# EasyEDA Pro project TTL to RS485 Converter V1.1.eprj

# Schematic TTL to RS485 Converter
Board Name: TTL to RS485 Converter; Create Date: 2026-04-04; Page Name: Sheet_1; Project Name: TTL to RS485 Converter V1.1; Schematic Name: TTL to RS485 Converter; Update Date: 2026-04-04; Add into BOM: yes; Company: Vision World Tech Pvt Ltd; Convert to PCB: yes; Date: 2025-11-25; REV: 1.0; Sheet: 1/1; spicePre: .
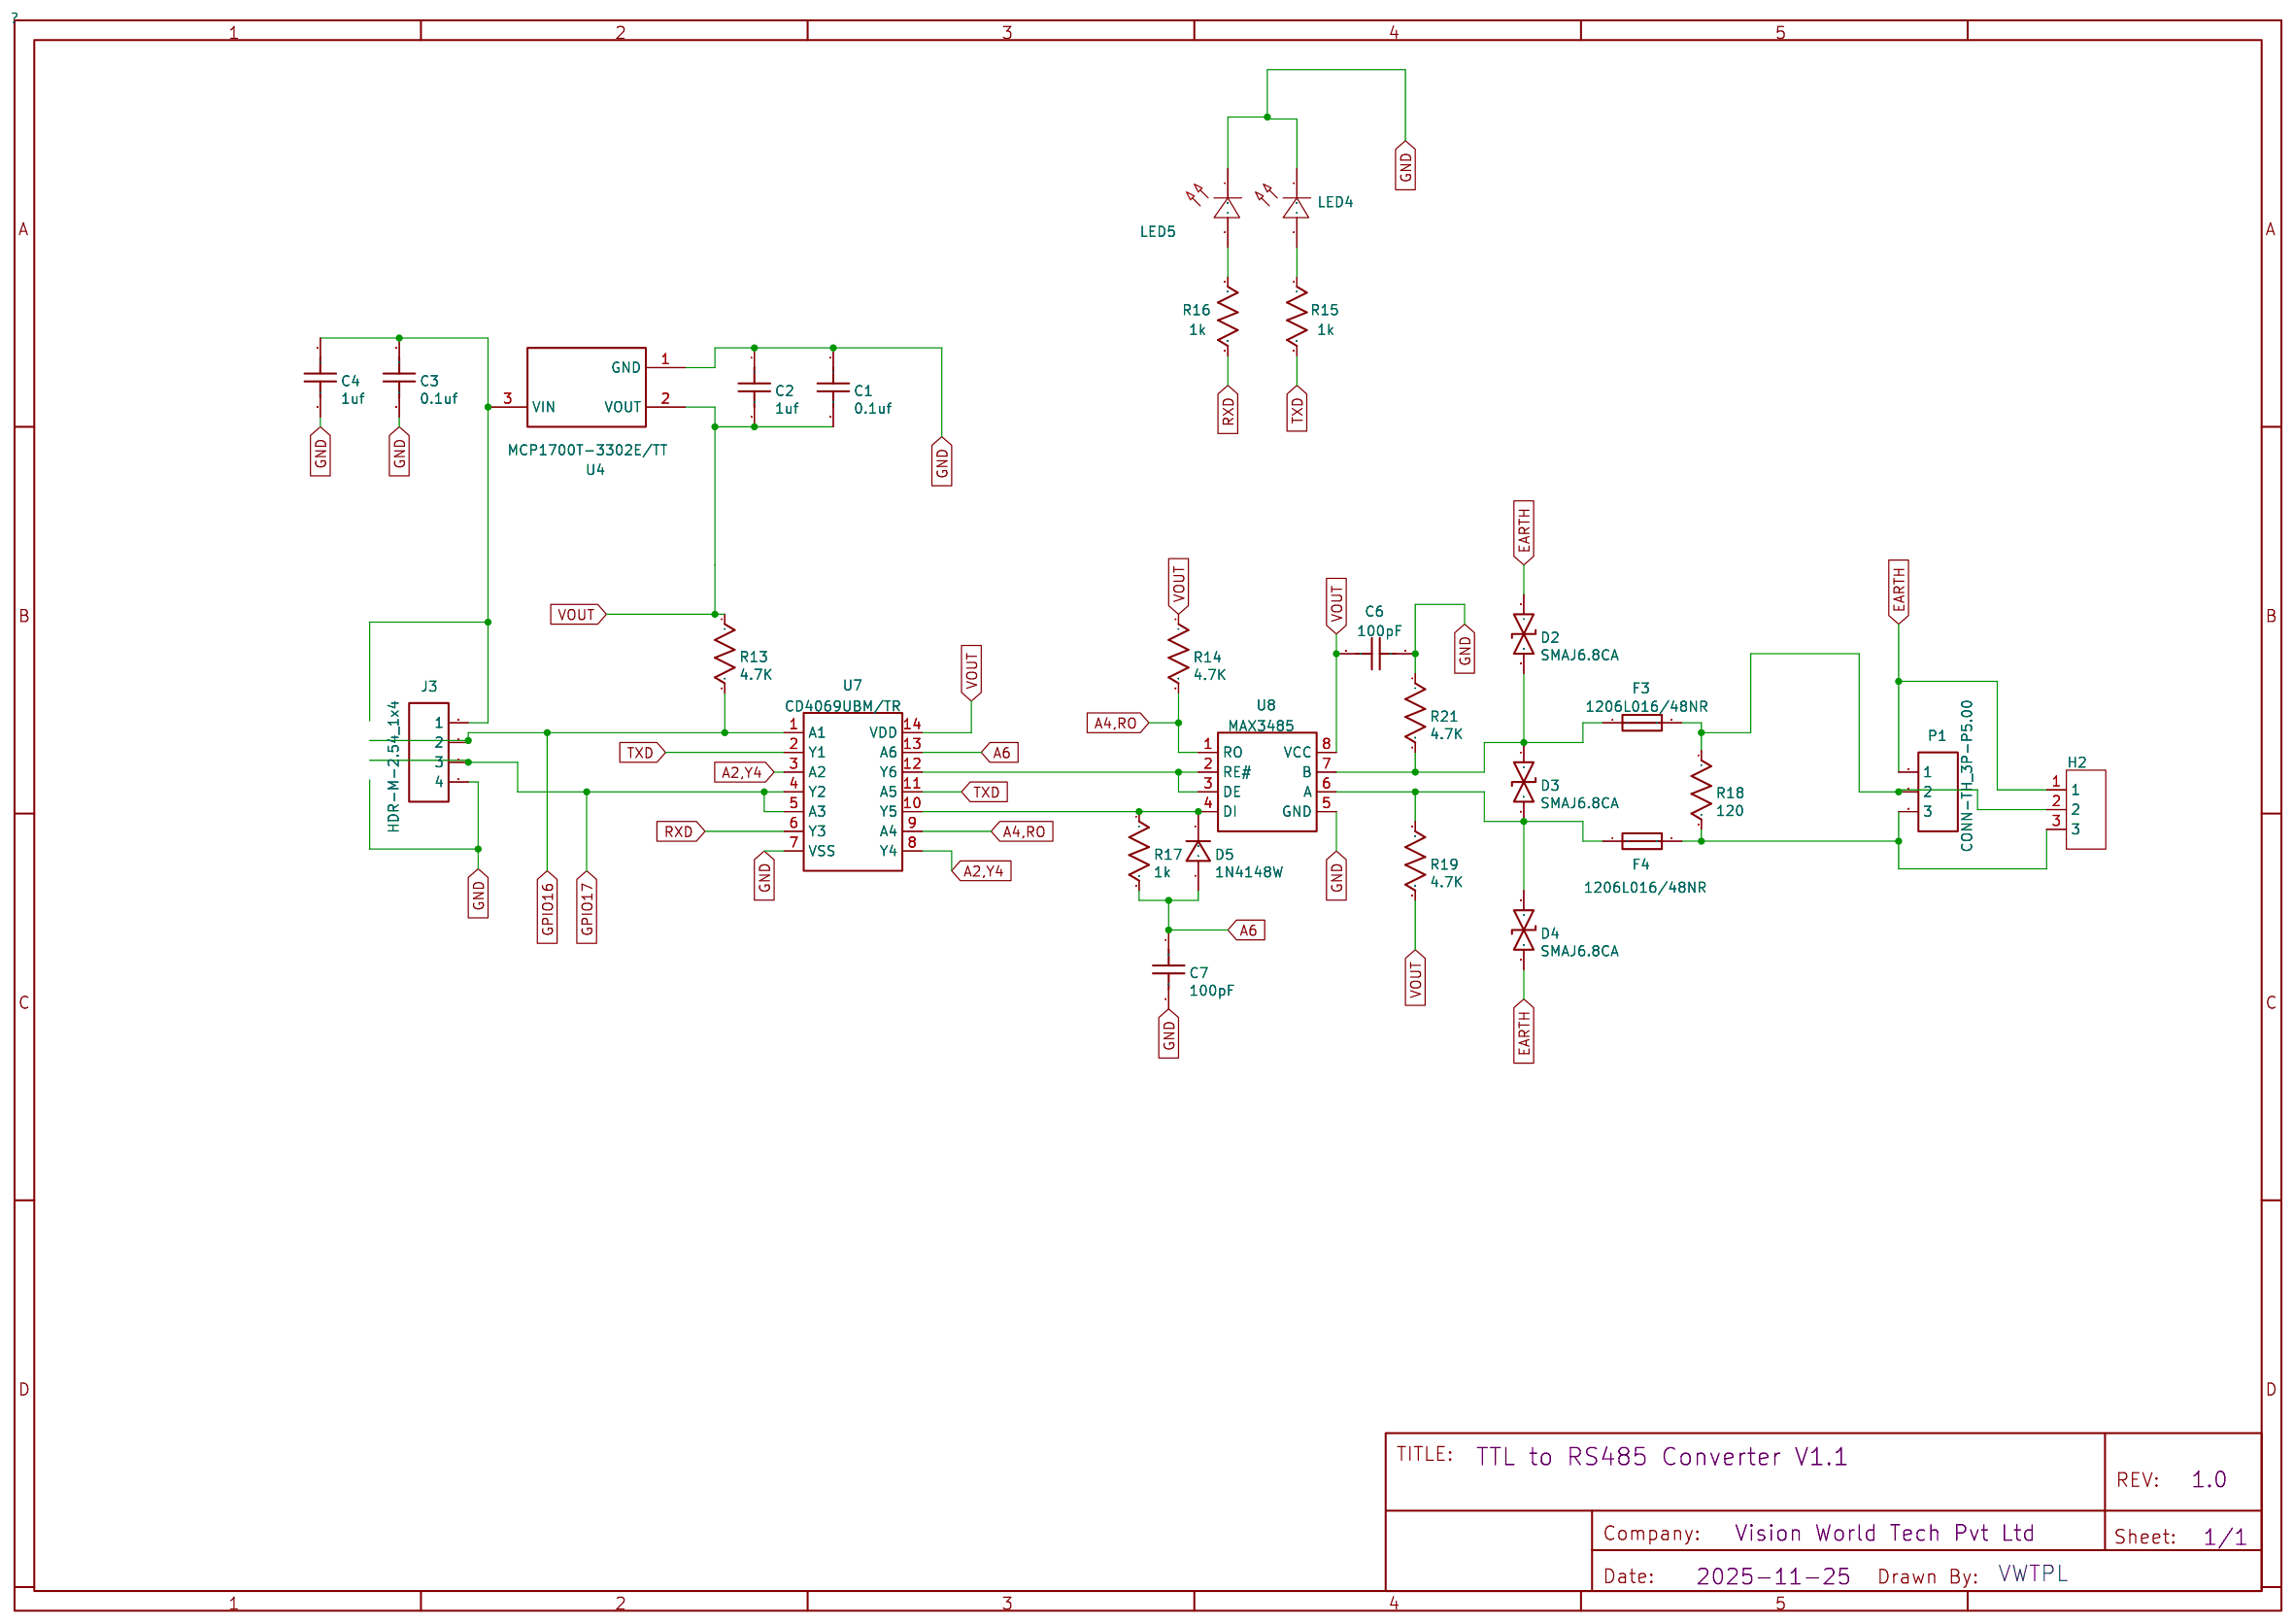
[diagram p0: schematic sheet]

## Parts
C1  0.1uf  [C1206]
C2  1uf  [C1206]
C3  0.1uf  [C1206]
C4  1uf  [C1206]
C6  100pF  [C1206]
C7  100pF  [C1206]
D2  SMAJ6.8CA  [SMA_L4.4-W2.6-LS5.0-BI]
D3  SMAJ6.8CA  [SMA_L4.4-W2.6-LS5.0-BI]
D4  SMAJ6.8CA  [SMA_L4.4-W2.6-LS5.0-BI]
D5  1N4148W  [SOD-123FL_L2.6-W1.6-LS3.4-RD]
F3  1206L016/48NR  [FUSE-SMD_1206L016-48NR]
F4  1206L016/48NR  [FUSE-SMD_1206L016-48NR]
H2  -  [HDR-TH_3P-P2.54-V-M]
J3  HDR-M-2.54_1x4  [HDR-M-2.54_1X4]
LED4  -  [LED0805-RD_GREEN]
LED5  -  [LED0805-RD_GREEN]
P1  CONN-TH_3P-P5.00  [CONN-TH_3P-P5.00]
R13  4.7K  [R1206]
R14  4.7K  [R1206]
R15  1k  [R1206]
R16  1k  [R1206]
R17  1k  [R1206]
R18  120  [R1206]
R19  4.7K  [R1206]
R21  4.7K  [R1206]
U4  MCP1700T-3302E/TT  [MCP1700-SOT-23-3_L2.9-W1.6-P1.90-LS2.8-BR]
U7  CD4069UBM/TR  [SOIC-14_L8.7-W3.9-P1.27-LS6.0-BL]
U8  MAX3485  [SOP-8_L4.9-W3.9-P1.27-LS6.0-BL]

## Library data of the parts
C1 C3 = 0.1uf: nameAlias: Value(F); Contributor: LCEDA_Lib; spicePre: C; spiceSymbolName: C_1206_US
C2 C4 = 1uf: nameAlias: Value(F); Contributor: LCEDA_Lib; spicePre: C; spiceSymbolName: C_1206_US
C6 C7 = 100pF: nameAlias: Value(F); Contributor: LCEDA_Lib; spicePre: C; spiceSymbolName: C_1206_US
D2-D4 = SMAJ6.8CA: Supplier: LCSC; Supplier Part: C406209; Manufacturer: BORN(伯恩半导体); JLCPCB Part Class: Extended Part; Contributor: LCSC; spicePre: D
D5 = 1N4148W: Supplier: LCSC; Manufacturer: Tak Cheong; Supplier Part: C129216; Contributor: LCEDA_Lib; spicePre: D
F3 F4 = 1206L016/48NR: Supplier: LCSC; Supplier Part: C7542930; Manufacturer: LUTE(陆特); JLCPCB Part Class: Extended Part; Contributor: lcsc; spicePre: F
H2 = HDR-M_2.54_1x3P: Supplier Footprint: Through
J3 = HDR-M-2.54_1x4: Supplier Part: C124378; Supplier: LCSC; Contributor: LCEDA_Lib; spicePre: J
LED4 = LED_0805-B: Supplier Footprint: 0805
LED5 = LED_0805-G: Supplier Footprint: 0805
P1 = CONN-TH_3P-P5.00: Supplier: LCSC; Contributor: LCEDA_Lib; spicePre: P
R13 R14 R19 R21 = 4.7K: nameAlias: Value(Ω); Contributor: LCEDA_Lib; spicePre: R; spiceSymbolName: R_1206_US
R15-R17 = 1k: nameAlias: Value(Ω); Contributor: LCEDA_Lib; spicePre: R; spiceSymbolName: R_1206_US
R18 = 120: nameAlias: Value(Ω); Contributor: LCEDA_Lib; spicePre: R; spiceSymbolName: R_1206_US
U4 = MCP1700T-3302E/TT: Supplier: LCSC; Manufacturer: MICROCHIP; image: //image.lceda.cn/szlcsc/C39051.jpg; Supplier Part: C39051; JLCPCB Part Class: Extend; LCSC Assembly: Yes; Contributor: Lavar Technologies; spicePre: U
U7 = CD4069UBM/TR: Supplier: LCSC; Supplier Part: C194330; Manufacturer: HGSEMI(华冠); JLCPCB Part Class: Extended Part; Contributor: LCSC; spicePre: U
U8 = MAX3485: Supplier: LCSC; Supplier Part: C41438299; Manufacturer: ElecSuper(静芯微); Manufacturer Part: MAX3485EIM/TR(ES); Contributor: lcsc; spicePre: U; spiceSymbolName: MAX3485EIM/TR(ES)

## Nets
GND: C1.1 C2.1 C3.2 C4.2 C6.1 C7.2 J3.4 LED4.1(C) LED5.1(C) R21.1 U4.1(GND) U7.7(VSS) U8.5(GND)
A2,Y4: U7.3(A2) U7.8(Y4)
A4,RO: R14.2 U7.9(A4) U8.1(RO)
A6: C7.1 D5.2 R17.2 U7.13(A6)
EARTH: D2.1 D4.2 H2.1 P1.1
GPIO16: J3.2 R13.2 U7.1(A1)
GPIO17: J3.3 U7.4(Y2) U7.5(A3)
RXD: R16.2 U7.6(Y3)
TXD: R15.2 U7.2(Y1) U7.11(A5)
VOUT: C1.2 C2.2 C6.2 R13.1 R14.1 R19.2 U4.2(VOUT) U7.14(VDD) U8.8(VCC)
$1N7: D5.1 R17.1 U7.10(Y5) U8.4(DI)
$1N9: U7.12(Y6) U8.2(RE#) U8.3(DE)
$1N18: D2.2 D3.1 F3.1 R21.2 U8.7(B)
$1N21: D3.2 D4.1 F4.1 R19.1 U8.6(A)
$1N22: F3.2 H2.2 P1.2 R18.1
$1N26: F4.2 H2.3 P1.3 R18.2
$1N31: LED5.2(A) R16.1
$1N32: LED4.2(A) R15.1
Net-(C3-1): C3.1 C4.1 J3.1 U4.3(VIN)

## Notes on the sheet
- VWTPL

# Board PCB_TTL to RS485 Converter
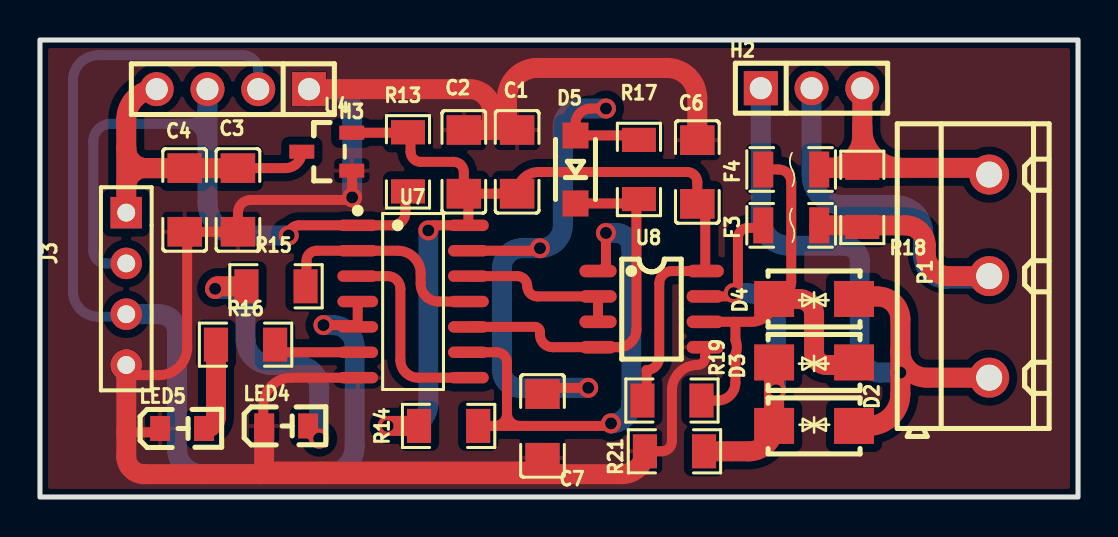
[diagram p1: board, top side]
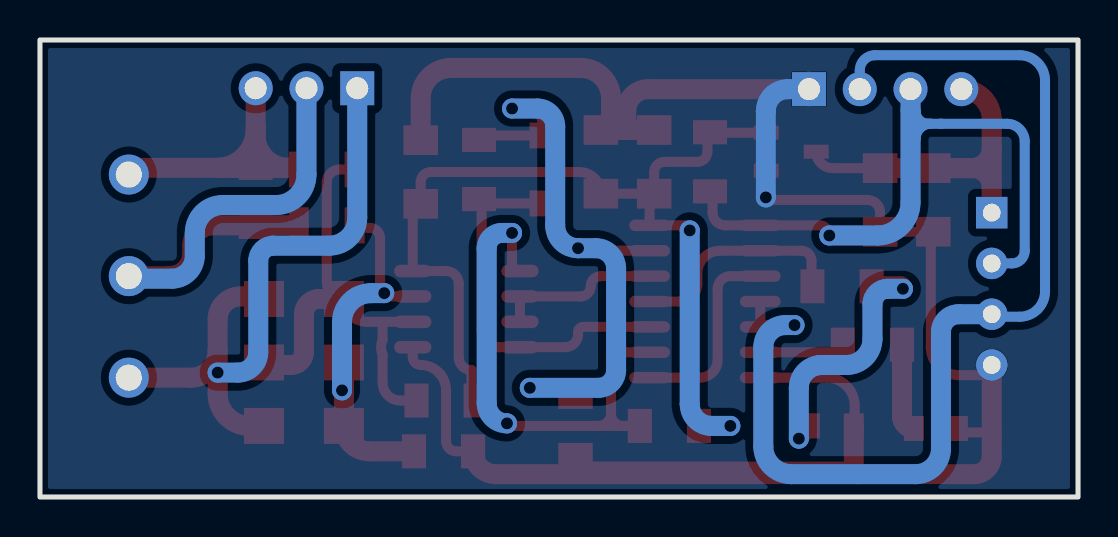
[diagram p2: board, bottom side, seen from below]

Outline 51.94 x 22.86 mm; copper layers: Top Layer, Bottom Layer. Coordinates in mm from the lower left corner of the outline.
Outline path: rectangle 0,22.86 51.94,0
Stack: Top Layer 0.035mm / Dielectric1 1.51mm FR4 er 4.5 / Bottom Layer 0.035mm

## Design rules (mm)
spacing Default (default): track to track 0.4, other pairs 0 to 0.4
track width Default (default): min 0.5, default 0.5, max 25.4
differential pair differentialPair (default): width min 0.127, default 0.254, max 2.54; gap min 0.152, default 0.152
via Default (default): diameter min 1, default 1, max 100.025; hole min 0.6, default 0.6, max 59.995

## Placement (name value [footprint] x y rotation side)
C1  0.1uf  [C1206]  23.88 16.76 270 top
C2  1uf  [C1206]  21.21 16.76 270 top
C3  0.1uf  [C1206]  9.91 14.86 270 top
C4  1uf  [C1206]  7.24 14.86 270 top
C6  100pF  [C1206]  32.89 16.26 270 top
C7  100pF  [C1206]  25.15 3.56 270 top
D2  SMAJ6.8CA  [SMA_L4.4-W2.6-LS5.0-BI]  38.74 3.56 180 top
D3  SMAJ6.8CA  [SMA_L4.4-W2.6-LS5.0-BI]  38.74 6.73 0 top
D4  SMAJ6.8CA  [SMA_L4.4-W2.6-LS5.0-BI]  38.74 9.91 0 top
D5  1N4148W  [SOD-123FL_L2.6-W1.6-LS3.4-RD]  26.8 16.38 270 top
F3  1206L016/48NR  [FUSE-SMD_1206L016-48NR]  37.59 13.59 0 top
F4  1206L016/48NR  [FUSE-SMD_1206L016-48NR]  37.59 16.38 0 top
H2  -  [HDR-TH_3P-P2.54-V-M]  38.61 20.45 0 top
H3  -  [HDR-TH_4P-P2.54-V-M]  9.65 20.4 180 top
J3  HDR-M-2.54_1x4  [HDR-M-2.54_1X4]  4.32 10.41 270 top
LED4  -  [LED0805-RD_GREEN]  12.32 3.56 0 top
LED5  -  [LED0805-RD_GREEN]  7.11 3.43 0 top
P1  -  [CONN-TH_3P-P5.00]  47.5 11.05 90 top
R13  4.7K  [R1206]  18.41 16.76 270 top
R14  4.7K  [R1206]  20.45 3.56 0 top
R15  1k  [R1206]  11.81 10.54 0 top
R16  1k  [R1206]  10.29 7.62 0 top
R17  1k  [R1206]  29.97 16.38 90 top
R18  120  [R1206]  41.15 14.99 90 top
R19  4.7K  [R1206]  31.62 4.83 180 top
R21  4.7K  [R1206]  31.75 2.29 0 top
U4  MCP1700T-3302E/TT  [MCP1700-SOT-23-3_L2.9-W1.6-P1.90-LS2.8-BR]  14.35 17.27 0 top
U7  CD4069UBM/TR  [SOIC-14_L8.7-W3.9-P1.27-LS6.0-BL]  18.67 9.78 270 top
U8  MAX3485  [SOP-8_L4.9-W3.9-P1.27-LS6.0-BL]  30.61 9.4 270 top

## Footprints (pads in the part's own frame, mm; a bottom-side part is the same pattern mirrored in y, then rotated)
C1206
  rect 1.485x1.728 smd: 1(-1.593,0) 2(1.593,0)
CONN-TH_3P-P5.00
  round 2 hole 1.3: 1(-5.08,0) 2(0,0) 3(5.08,0)
FUSE-SMD_1206L016-48NR
  rect 1x1.8 smd: 1(-1.4,0) 2(1.4,0)
HDR-M-2.54_1X4
  rect 1.575x1.575 hole 0.889: 1(-3.81,0)
  round 1.575 hole 0.889: 2(-1.27,0) 3(1.27,0) 4(3.81,0)
HDR-TH_3P-P2.54-V-M
  rect 1.7x1.7 hole 1.1: 1(-2.54,0)
  round 1.7 hole 1.1: 2(0,0) 3(2.54,0)
HDR-TH_4P-P2.54-V-M
  rect 1.7x1.7 hole 1.1: 1(-3.81,0)
  round 1.7 hole 1.1: 2(-1.27,0) 3(1.27,0) 4(3.81,0)
LED0805-RD_GREEN
  rect 1x1.25 smd: 1(-1.1,0) 2(1.1,0)
MCP1700-SOT-23-3_L2.9-W1.6-P1.90-LS2.8-BR
  rect 1.25x0.7 smd: 1(1.25,-0.95) 2(1.25,0.95) 3(-1.25,0)
R1206
  rect 1.208x1.701 smd: 1(-1.479,0) 2(1.479,0)
SMA_L4.4-W2.6-LS5.0-BI
  rect 2x1.8 smd: 1(-2,0) 2(2,0)
SOD-123FL_L2.6-W1.6-LS3.4-RD
  rect 1.3x1.3 smd: 1(1.7,0) 2(-1.7,0)
SOIC-14_L8.7-W3.9-P1.27-LS6.0-BL
  oval 0.574x2.038 smd: 1(-3.81,-2.769) 2(-2.54,-2.769) 3(-1.27,-2.769) 4(0,-2.769) 5(1.27,-2.769) 6(2.54,-2.769) 7(3.81,-2.769) 8(3.81,2.769) 9(2.54,2.769) 10(1.27,2.769) 11(0,2.769) 12(-1.27,2.769) 13(-2.54,2.769) 14(-3.81,2.769)
SOP-8_L4.9-W3.9-P1.27-LS6.0-BL
  oval 0.63x1.865 smd: 1(-1.905,-2.683) 2(-0.635,-2.683) 3(0.635,-2.683) 4(1.905,-2.683) 5(1.905,2.683) 6(0.635,2.683) 7(-0.635,2.683) 8(-1.905,2.683)

## Nets
GND: C1.1 C2.1 C3.2 C4.2 C6.1 C7.2 H3.1 J3.4 LED4.1 LED5.1 R21.1 U4.1 U7.7 U8.5
A2,Y4: U7.3 U7.8
A4,RO: R14.2 U7.9 U8.1
A6: C7.1 D5.2 R17.2 U7.13
EARTH: D2.1 D4.2 H2.1 P1.1
GPIO16: H3.3 J3.2 R13.2 U7.1
GPIO17: H3.2 J3.3 U7.4 U7.5
RXD: R16.2 U7.6
TXD: R15.2 U7.2 U7.11
VOUT: C1.2 C2.2 C6.2 R13.1 R14.1 R19.2 U4.2 U7.14 U8.8
$1N7: D5.1 R17.1 U7.10 U8.4
$1N9: U7.12 U8.2 U8.3
$1N18: D2.2 D3.1 F3.1 R21.2 U8.7
$1N21: D3.2 D4.1 F4.1 R19.1 U8.6
$1N22: F3.2 H2.2 P1.2 R18.1
$1N26: F4.2 H2.3 P1.3 R18.2
$1N31: LED5.2 R16.1
$1N32: LED4.2 R15.1
$1N35: C3.1 C4.1 H3.4 J3.1 U4.3

## Via types
v1: diameter 1, hole 0.6, Top Layer to Bottom Layer, 15 vias

## Routing (per net, layer and track width the routed paths; a pad name or vN(x,y) marks a point on that pad's centre or on a via; arc(x,y) is an arc through that point)
GND: length 120.3
  Top Layer w0.5: 4.32,6.1 5.97,6.1 arc(6.96,6.51) 7.37,7.49 7.37,13.27 ; 7.37,13.27 C3.2 9.91,14.22 arc(10.09,14.67) 10.54,14.86 15.49,14.86 arc(15.58,14.9) v1(15.62,14.99) 15.62,16.3 arc(15.61,16.32) U4.1 ; 7.37,13.27 C4.2 ; R21.1 31.12,2.29 arc(31.47,2.43) 31.62,2.79 31.62,5.33 arc(31.7,5.77) 31.92,6.15 arc(32.36,6.49) 32.89,6.6 arc(33.17,6.72) 33.29,7 U8.5 ; 11.18,3.56 11.18,4.57 arc(11.59,5.56) 12.57,5.97 U7.7 ; 4.32,3.23 5.81,3.23 arc(5.95,3.29) LED5.1 ; 11.22,1.52 25.15,1.52 ; 22.61,18.38 arc(22.6,18.36) 22.58,18.36
  Top Layer w1: 22.61,18.38 22.61,19.3 arc(22.28,20.08) 21.51,20.4 H3.1 ; 11.04,1.14 5.21,1.14 arc(4.58,1.4) 4.32,2.03 J3.4 ; 11.04,1.14 29.13,1.14 arc(29.94,1.48) R21.1 ; 11.04,1.14 arc(11.17,1.19) 11.22,1.32 LED4.1 ; C6.1 32.89,19.94 arc(32.45,21.02) 31.37,21.46 24.89,21.46 arc(23.81,21.02) 23.37,19.94 23.37,18.86 arc(23.52,18.51) C1.1 C2.1
  Bottom Layer w0.5: 13.46,20.3 13.46,20.27
  Bottom Layer w1: v1(15.62,14.99) 15.62,19.3 arc(15.3,20.08) 14.53,20.4 H3.1
A2,Y4: length 10
  Top Layer w0.5: U7.3 17.4,11.05 arc(17.85,10.86) 18.03,10.41 18.03,6.86 arc(18.29,6.23) 18.92,5.97 U7.8
A4,RO: length 28
  Top Layer w0.5: 22.18,3.56 22.77,3.56 arc(23.19,3.73) 23.37,4.15 23.37,4.96 ; v1(28.32,13.21) 28.32,11.7 arc(28.2,11.42) U8.1 ; U7.9 22.86,7.24 arc(23.22,7.09) 23.37,6.73 23.37,4.19 arc(23.55,3.74) 24,3.56 ; R14.2 24,3.56 ; 24,3.56 28.45,3.56 arc(28.54,3.59) v1(28.58,3.68)
  Bottom Layer w1: v1(28.32,13.21) 28.83,13.21 arc(29.37,12.98) 29.59,12.45 29.59,4.7 arc(29.29,3.98) v1(28.58,3.68)
A6: length 33.8
  Top Layer w0.5: U7.13 24.89,12.32 arc(24.98,12.36) v1(25.02,12.45) ; v1(28.32,19.43) 27.56,19.43 arc(27.02,19.21) 26.8,18.67 D5.2 29.75,18.08 arc(29.91,18.02) R17.2 ; v1(27.43,5.46) 25.46,5.46 arc(25.24,5.37) C7.1
  Bottom Layer w1: v1(27.43,5.46) 24,5.46 arc(23.37,5.72) 23.11,6.35 23.11,11.43 arc(23.41,12.15) 24.13,12.45 v1(25.02,12.45) arc(25.83,12.78) 26.16,13.59 26.16,18.54 arc(26.42,19.17) 27.05,19.43 v1(28.32,19.43)
EARTH: length 35.3
  Top Layer w1: 43.05,7.3 v1(43.05,6.22) 43.05,5.16 arc(42.58,4.02) 41.45,3.56 D2.1 ; 43.05,7.3 43.05,8.89 arc(42.72,9.7) 41.91,10.03 40.86,10.03 arc(40.77,10) D4.2 ; 43.05,7.3 arc(43.13,6.86) 43.35,6.46 arc(43.81,6.1) 44.38,5.97 P1.1
  Bottom Layer w0.5: 36.06,20.04 36.06,20.28
  Bottom Layer w1: v1(43.05,6.22) 42.04,6.22 arc(41.32,6.52) 41.02,7.24 41.02,11.81 arc(40.8,12.35) 40.26,12.57 37.47,12.57 arc(36.48,12.98) 36.07,13.97 H2.1
GPIO16: length 36.2
  Top Layer w0.5: R13.2 arc(18.33,15.25) 18.29,15.16 18.29,14.22 arc(18.1,13.77) 17.65,13.59 U7.1 12.95,13.59 arc(12.59,13.44) v1(12.45,13.08)
  Bottom Layer w0.5: J3.2 3.3,11.68 arc(2.85,11.87) 2.67,12.32 2.67,17.78 arc(2.93,18.41) 3.56,18.67 7.71,18.67 arc(8.19,18.86) 8.38,19.34 ; 6.84,18.67 6.89,18.67 6.84,18.67 ; 7.37,18.67 arc(7.9,18.45) 8.13,17.91 8.13,19.3 arc(7.94,18.85) 7.49,18.67 7.37,18.67
  Bottom Layer w1: v1(12.45,13.08) 10.03,13.08 arc(8.87,13.56) 8.38,14.73 H3.3
GPIO17: length 54.9
  Top Layer w0.5: v1(14.19,8.6) 15.81,8.6 arc(15.87,8.57) U7.5 U7.4
  Bottom Layer w0.5: H3.2 10.92,21.34 arc(10.7,21.87) 10.16,22.1 2.92,22.1 arc(2.02,21.73) 1.65,20.83 1.65,10.29 arc(2.02,9.39) 2.92,9.02 4.19,9.02 arc(4.28,9.05) J3.3
  Bottom Layer w1: v1(14.19,8.6) 14.64,8.6 arc(15.42,8.28) 15.75,7.5 15.75,2.54 arc(15.34,1.55) 14.35,1.14 8.13,1.14 arc(7.23,1.51) 6.86,2.41 6.86,8.26 arc(6.6,8.88) 5.97,9.14 J3.3
RXD: length 4.1
  Top Layer w0.5: U7.6 11.77,7.24
TXD: length 11.4
  Top Layer w0.5: U7.11 19.94,9.78 arc(19.31,10.04) 19.05,10.67 19.05,11.18 arc(18.72,11.98) 17.91,12.32 U7.2 13.84,12.32 arc(13.48,12.17) 13.34,11.81 13.34,10.59 arc(13.32,10.55) 13.29,10.54
VOUT: length 51.2
  Top Layer w0.5: C2.2 21.21,16.26 arc(21.06,16.62) 20.7,16.76 19.05,16.76 arc(18.69,16.91) 18.54,17.27 18.54,18.12 arc(18.5,18.21) R13.1 arc(18.41,18.23) 18.39,18.22 U4.2 ; C2.2 C1.2 arc(24.19,15.94) 24.96,16.26 32.38,16.26 arc(32.74,16.11) 32.89,15.75 C6.2 arc(33.17,14.55) 33.29,14.27 U8.8 31.62,11.3 arc(31.17,11.12) 30.99,10.67 30.99,6.98 arc(30.8,6.54) 30.35,6.35 30.35,5.04 arc(30.29,4.89) 30.14,4.83 ; C2.2 arc(21.37,15.1) 21.44,14.94 U7.14 19.69,13.59 arc(19.51,13.51) v1(19.43,13.34)
  Top Layer w1: v1(17.4,3.56) 18.97,3.56
  Bottom Layer w1: v1(17.4,3.56) 18.34,3.56 arc(19.11,3.88) 19.43,4.65 v1(19.43,13.34)
$1N7: length 19.2
  Top Layer w0.5: D5.1 29.75,14.68 ; 29.75,14.68 arc(29.91,14.75) R17.1 ; 29.75,14.68 arc(29.82,14.65) 29.84,14.59 29.84,8.38 arc(29.58,7.75) 28.96,7.49 U8.4 25.65,7.49 arc(25.2,7.68) 25.02,8.13 25.02,8.26 arc(24.94,8.43) 24.77,8.51 U7.10
$1N9: length 8.3
  Top Layer w0.5: U8.3 U8.2 24.89,10.03 arc(24.53,10.18) 24.38,10.54 arc(24.24,10.9) 23.88,11.05 U7.12
$1N18: length 19.7
  Top Layer w0.5: U8.7 34.55,10.03 arc(34.67,10.08) v1(34.72,10.2) arc(34.87,10.41) 34.93,10.67 34.93,12.95 arc(35.07,13.31) 35.43,13.46 36.06,13.46 arc(36.15,13.5) F3.1
  Top Layer w1: D3.1 D2.2 arc(36.36,2.66) 35.47,2.29 R21.2
  Bottom Layer w1: v1(36.83,5.33) 36.83,8.74 arc(36.4,9.77) 35.38,10.2 v1(34.72,10.2)
$1N21: length 24.3
  Top Layer w0.5: R19.1 33.91,4.83 arc(34.54,5.09) 34.8,5.72 34.8,7.12 arc(34.87,7.49) 34.8,7.86 34.8,8.68 arc(34.77,8.74) 34.72,8.76 ; F4.1 36.96,16.38 arc(37.41,16.2) 37.59,15.75 37.59,10.76 arc(37.34,10.16) D4.1 arc(36.4,9.1) 35.59,8.76 34.72,8.76 ; 34.72,8.76 U8.6
  Top Layer w1: D4.1 37.97,9.91 arc(38.51,9.68) 38.74,9.14 38.74,7.24 arc(38.92,6.79) 39.37,6.6 40.61,6.6 arc(40.7,6.64) D3.2
$1N22: length 27
  Top Layer w0.5: R18.1 arc(41.12,13.56) 41.07,13.59
  Top Layer w1: P1.2 45.47,11.05 arc(44.66,11.38) 44.32,12.19 44.32,12.57 arc(44.03,13.29) 43.31,13.59 41.23,13.59 arc(41.17,13.56) R18.1 ; 41.07,13.59 F3.2
  Bottom Layer w1: H2.2 38.61,16.13 arc(39.05,15.05) 40.13,14.61 42.8,14.61 arc(43.79,14.2) 44.2,13.21 44.2,12.07 arc(44.53,11.26) 45.34,10.92 47.37,10.92 arc(47.46,10.96) P1.2
$1N26: length 22
  Top Layer w1: 41.15,18.56 41.15,18.41 arc(41.72,17.03) 43.09,16.47 39.53,16.47 arc(40.67,16.94) 41.15,18.09 ; H2.3 R18.2 ; R18.2 39.07,16.47 arc(39.02,16.44) F4.2 ; R18.2 47.16,16.47 arc(47.4,16.37) P1.3
$1N31: length 4.5
  Top Layer w1: R16.1 8.81,4.03 arc(8.63,3.6) LED5.2
$1N32: length 13.9
  Top Layer w0.5: LED4.2 13.42,3.47 arc(13.58,3.08) v1(13.97,2.92)
  Top Layer w1: R15.1 8.89,10.54 arc(8.8,10.5) v1(8.76,10.41)
  Bottom Layer w1: v1(13.97,2.92) 13.97,5.46 arc(13.68,6.22) 12.97,6.6 arc(12.9,6.6) 12.83,6.6 11.59,6.6 arc(10.67,6.99) 10.29,7.91 10.29,9.65 arc(10.06,10.19) 9.53,10.41 v1(8.76,10.41)
$1N35: length 20.3
  Top Layer w0.5: C3.1 12.28,16.45 arc(12.86,16.69) U4.3
  Top Layer w1: 4.32,15.49 arc(4.6,16.17) 5.28,16.45 C4.1 ; C4.1 5.32,16.45 arc(5.16,16.47) 5,16.51 arc(4.5,16.87) 4.32,17.45 ; C4.1 C3.1 ; J3.1 4.32,17.45 ; 4.32,17.45 4.32,18.88 arc(4.76,19.95) H3.4

## Copper pours and planes (outline as drawn; the poured copper is in the pictures)
GND on Top Layer: 0,22.86 51.94,22.86 51.94,0 0,0
GND on Bottom Layer: 0,22.86 51.94,22.86 51.94,0 0,0
